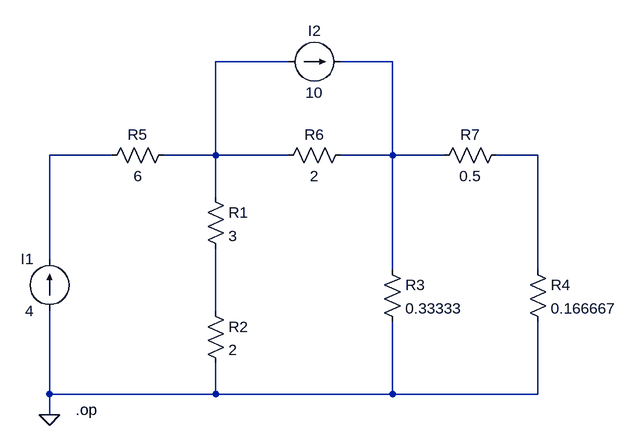
[diagram p0: schematic CH03-KP2-09.asc]
CH03-KP2-09.asc, the LTspice schematic file:
Version 4
SHEET 1 880 680
WIRE 192 16 80 16
WIRE 352 16 272 16
WIRE -80 160 -176 160
WIRE 80 160 80 16
WIRE 80 160 0 160
WIRE 192 160 80 160
WIRE 352 160 352 16
WIRE 352 160 272 160
WIRE 432 160 352 160
WIRE 576 160 512 160
WIRE 80 224 80 160
WIRE -176 320 -176 160
WIRE 352 336 352 160
WIRE 576 336 576 160
WIRE 80 400 80 304
WIRE -176 528 -176 400
WIRE 80 528 80 480
WIRE 80 528 -176 528
WIRE 352 528 352 416
WIRE 352 528 80 528
WIRE 576 528 576 416
WIRE 576 528 352 528
WIRE -176 560 -176 528
FLAG -176 560 0
DATAFLAG -160 160 "$"
DATAFLAG 96 160 "$"
DATAFLAG 384 160 "$"
DATAFLAG 576 160 "$"
SYMBOL res 64 208 R0
SYMATTR InstName R1
SYMATTR Value 3
SYMBOL res 64 384 R0
SYMATTR InstName R2
SYMATTR Value 2
SYMBOL res 336 320 R0
SYMATTR InstName R3
SYMATTR Value 0.33333
SYMBOL res 560 320 R0
SYMATTR InstName R4
SYMATTR Value 0.166667
SYMBOL res 16 144 R90
WINDOW 0 0 56 VBottom 2
WINDOW 3 32 56 VTop 2
SYMATTR InstName R5
SYMATTR Value 6
SYMBOL res 288 144 R90
WINDOW 0 0 56 VBottom 2
WINDOW 3 32 56 VTop 2
SYMATTR InstName R6
SYMATTR Value 2
SYMBOL res 528 144 R90
WINDOW 0 0 56 VBottom 2
WINDOW 3 32 56 VTop 2
SYMATTR InstName R7
SYMATTR Value 0.5
SYMBOL current -176 400 R180
WINDOW 0 24 80 Left 2
WINDOW 3 24 0 Left 2
SYMATTR InstName I1
SYMATTR Value 4
SYMBOL current 192 16 R270
WINDOW 0 32 40 VTop 2
WINDOW 3 -32 40 VBottom 2
SYMATTR InstName I2
SYMATTR Value 10
TEXT -136 552 Left 2 !.op

The netlist it stands for:
* CH03-KP2-09.asc
R1 N001 N005 3
R2 N005 0 2
R3 N002 0 0.33333
R4 N004 0 0.166667
R5 N001 N003 6
R6 N002 N001 2
R7 N004 N002 0.5
I1 0 N003 4
I2 N001 N002 10
.op
.backanno
.end